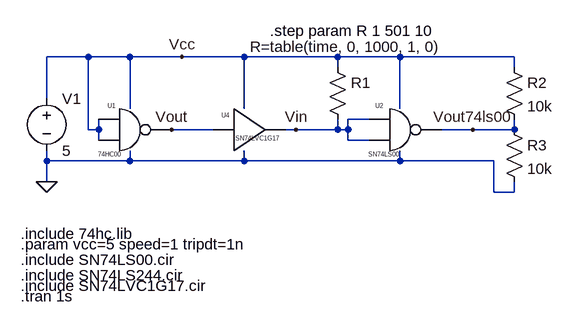
[diagram p0: schematic cmos-ttl_interface_sprint_0.asc]
cmos-ttl_interface_sprint_0.asc, the LTspice schematic file:
Version 4
SHEET 1 880 680
WIRE 48 -32 -16 -32
WIRE 112 -32 48 -32
WIRE 192 -32 112 -32
WIRE 288 -32 192 -32
WIRE 432 -32 288 -32
WIRE 528 -32 432 -32
WIRE 704 -32 528 -32
WIRE 432 -16 432 -32
WIRE 704 -16 704 -32
WIRE -16 32 -16 -32
WIRE 112 48 112 -32
WIRE 288 48 288 -32
WIRE 528 48 528 -32
WIRE 480 64 448 64
WIRE 48 80 48 -32
WIRE 64 80 64 64
WIRE 64 80 48 80
WIRE 240 80 176 80
WIRE 368 80 352 80
WIRE 432 80 432 64
WIRE 432 80 368 80
WIRE 448 80 448 64
WIRE 448 80 432 80
WIRE 640 80 592 80
WIRE 704 80 704 64
WIRE 704 80 640 80
WIRE 64 96 64 80
WIRE 448 96 448 80
WIRE 480 96 448 96
WIRE -16 128 -16 112
WIRE 112 128 112 112
WIRE 112 128 -16 128
WIRE 288 128 288 112
WIRE 288 128 112 128
WIRE 528 128 528 112
WIRE 528 128 288 128
WIRE 672 128 528 128
WIRE -16 160 -16 128
WIRE 672 176 672 128
WIRE 704 176 704 160
WIRE 704 176 672 176
FLAG -16 160 0
FLAG 192 -32 Vcc
FLAG 176 80 Vout
FLAG 368 80 Vin
FLAG 640 80 Vout74ls00
SYMBOL voltage -16 16 R0
WINDOW 123 0 0 Left 0
WINDOW 39 0 0 Left 0
SYMATTR InstName V1
SYMATTR Value 5
SYMBOL 74hc00 112 16 R0
SYMATTR InstName U1
SYMBOL SN74LS00 528 16 R0
SYMATTR InstName U2
SYMBOL res 416 -32 R0
WINDOW 3 -119 -16 Left 2
SYMATTR Value R=table(time, 0, 1000, 1, 0)
SYMATTR InstName R1
SYMBOL SN74LVC1G17 288 16 R0
SYMATTR InstName U4
SYMBOL res 688 -32 R0
SYMATTR InstName R2
SYMATTR Value 10k
SYMBOL res 688 64 R0
SYMATTR InstName R3
SYMATTR Value 10k
TEXT -56 240 Left 2 !.include 74hc.lib
TEXT -56 280 Left 2 !.include SN74LS00.cir
TEXT -56 336 Left 2 !.tran 1s
TEXT -56 256 Left 2 !.param vcc=5 speed=1 tripdt=1n
TEXT -56 304 Left 2 !.include SN74LS244.cir
TEXT 328 -72 Left 2 !.step param R 1 501 10
TEXT -56 320 Left 2 !.include SN74LVC1G17.cir

The netlist it stands for:
* cmos-ttl_interface_sprint_0.asc
V1 Vcc 0 5
XU1 Vcc Vcc Vout Vcc 0 74HC00 74HC00  ; pins A B Y VCC VGND
XU2 Vout74ls00 Vin Vin Vcc 0 SN74LS00 SN74LS00  ; pins Y A B VCC AGND
R1 Vcc Vin R=table(time, 0, 1000, 1, 0)
XU4 Vin Vout Vcc 0 SN74LVC1G17 SN74LVC1G17  ; pins Y A VCC AGND
R2 Vcc Vout74ls00 10k
R3 Vout74ls00 0 10k
.include 74hc.lib
.include SN74LS00.cir
.tran 1s
.param vcc=5 speed=1 tripdt=1n
.include SN74LS244.cir
.step param R 1 501 10
.include SN74LVC1G17.cir
.lib 74hc.lib
.lib SN74LS00.cir
.lib SN74LVC1G17.cir
.backanno
.end